# EasyEDA Pro project 数控电源_V3.eprj, schematic Schematic4
Board Name: type 端子; Create Date: 2025-09-15; Page Name: P1; Project Name: 数控电源_V3; Schematic Name: Schematic4; Update Date: 2025-09-15; Company: 嘉立创EDA; Page Size: A2; Version: V3
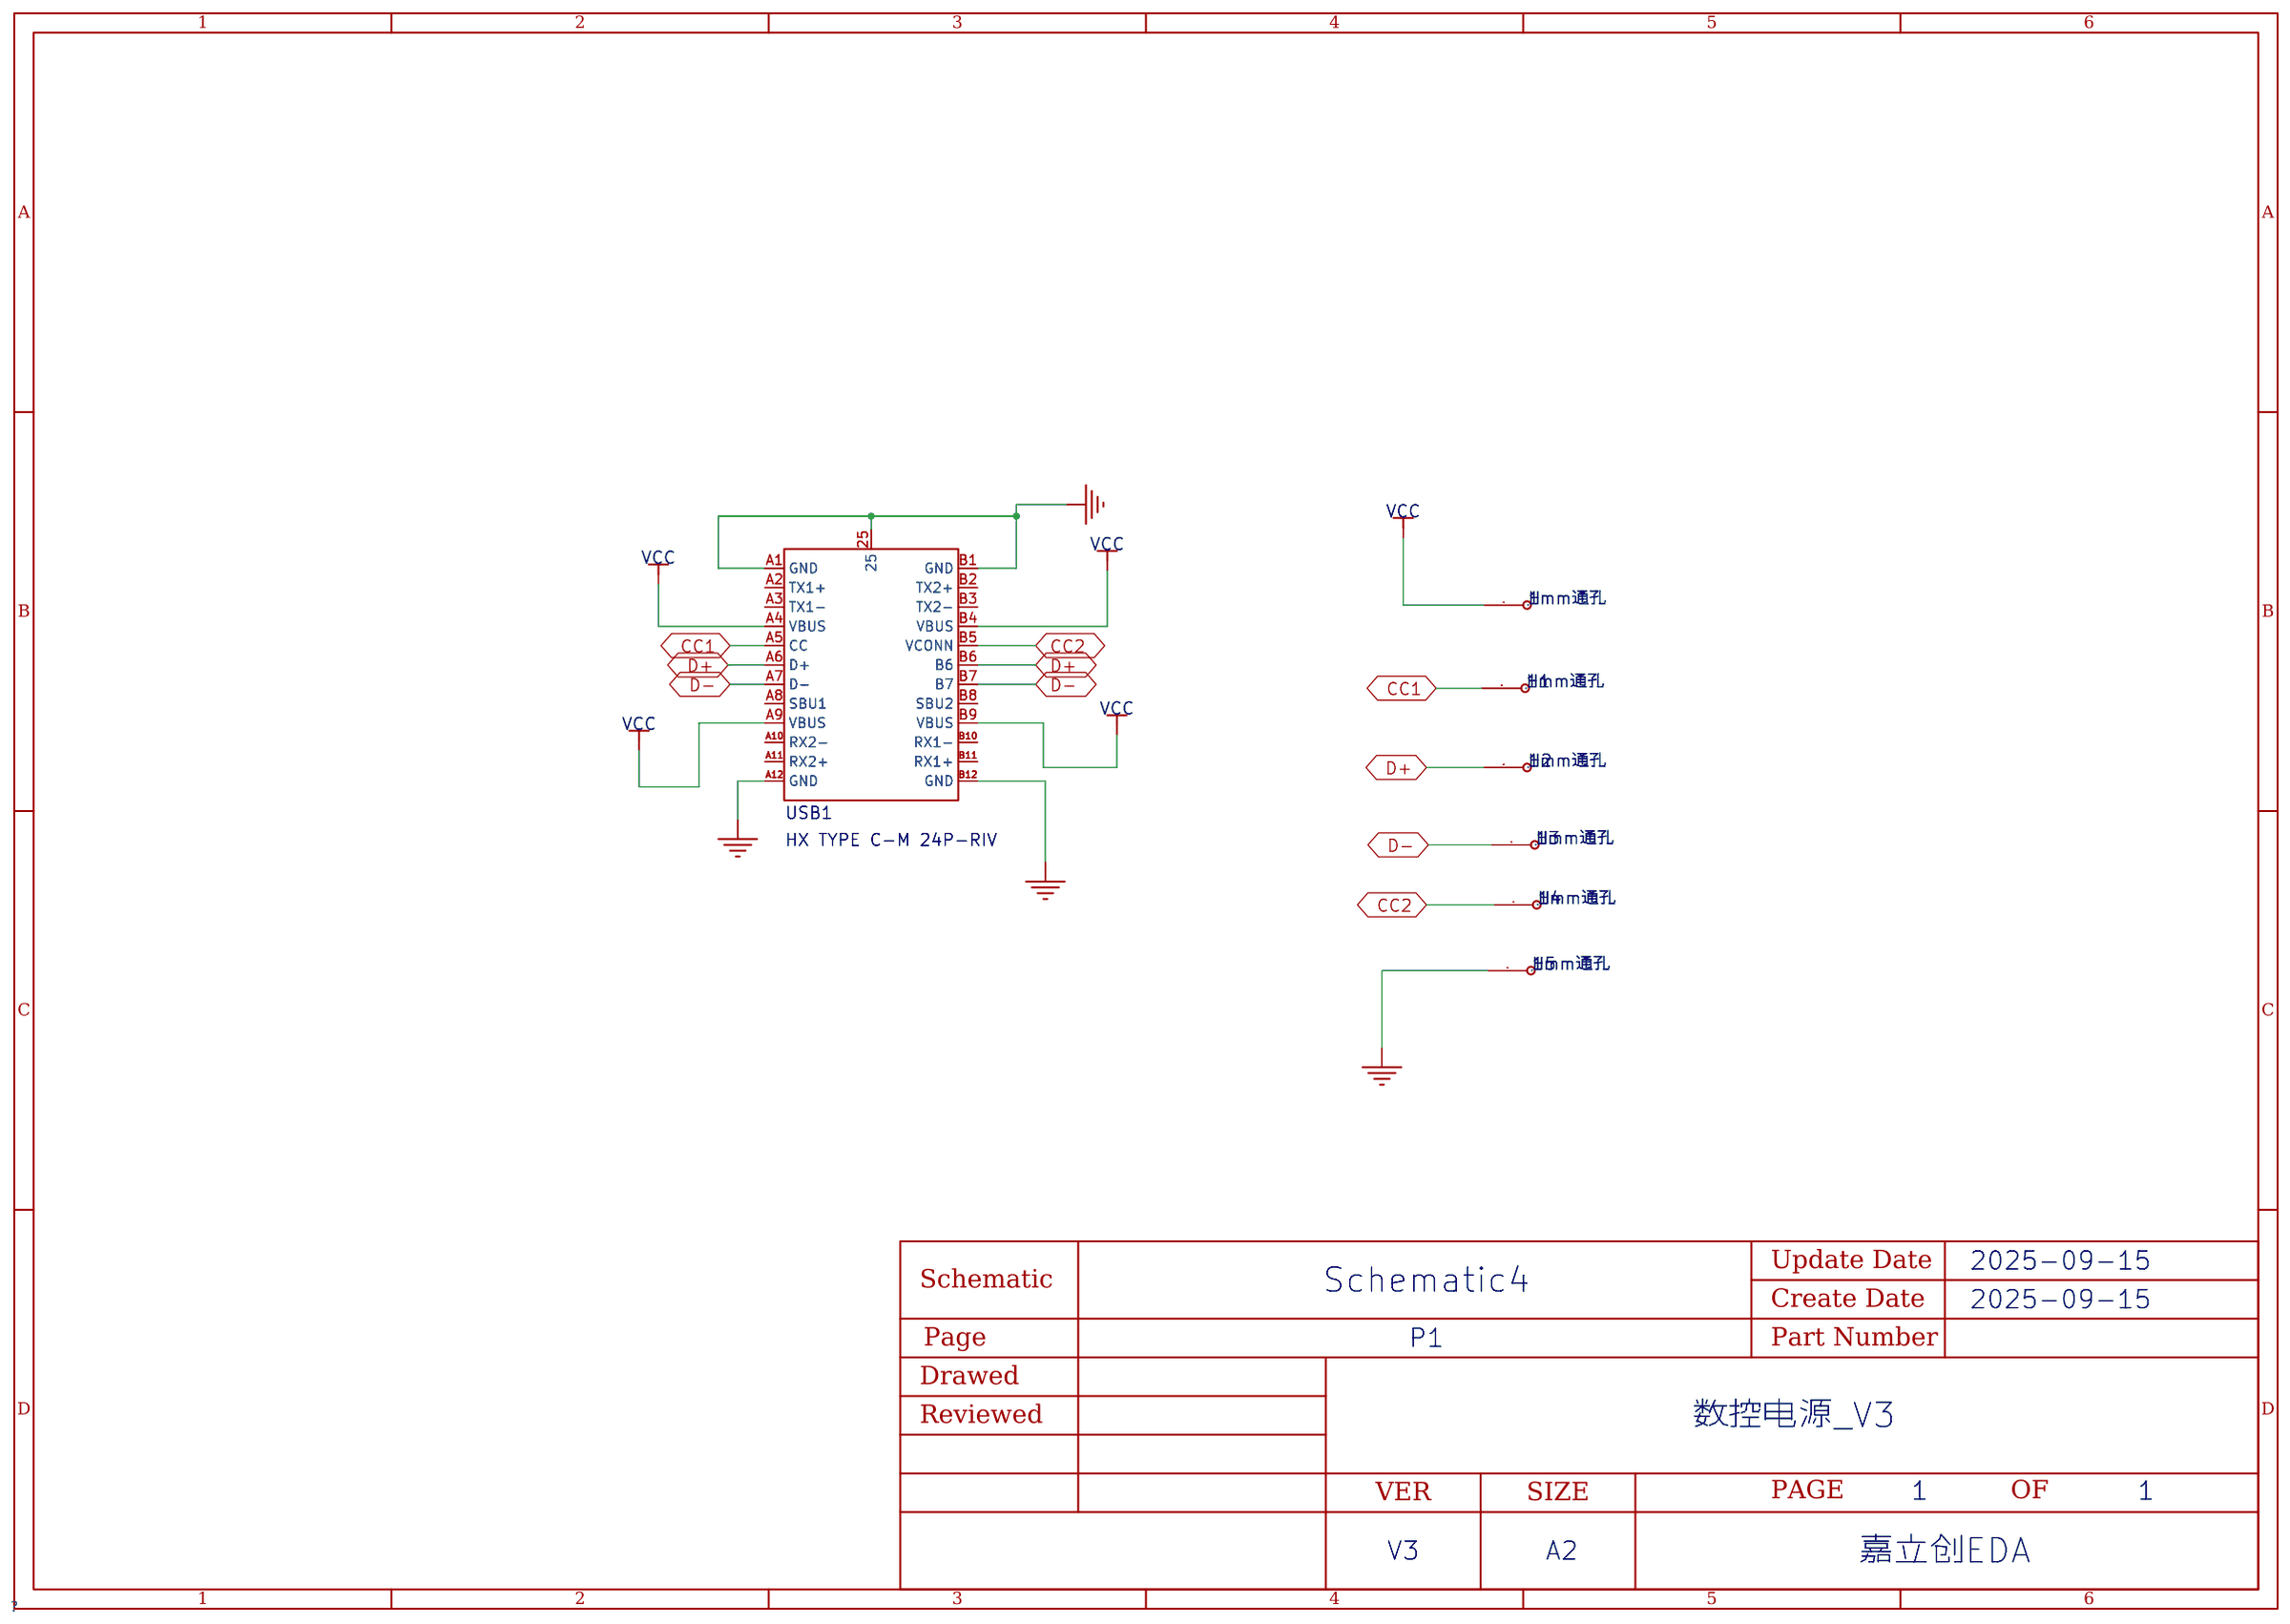
[diagram p1: schematic sheet]

## Parts
H  1mm通孔  [DC-1-DIP]
H1  1mm通孔  [DC-1-DIP]
H2  1mm通孔  [DC-1-DIP]
H3  1mm通孔  [DC-1-DIP]
H4  1mm通孔  [DC-1-DIP]
H5  1mm通孔  [DC-1-DIP]
USB1  HX TYPE C-M 24P-RIV  [TYPE-C-SMD_TYPEC-PLUG-24PIN]

## Library data of the parts
H H1-H5 = DC-1-DIP: 孔径1mm通孔
USB1 = HX TYPE C-M 24P-RIV: 连接器类型:Type-C;协议标准:-;公母:公;安装方式:夹板;触点数量:24P;端口数量:1;额定电流 - 电源:5A;工作温度:-30℃~+80℃;; LCSC Part Name: Type-C 公 夹板; Supplier Part: C42453852; Manufacturer: hanxia(韩下); Supplier Footprint: SMD; Datasheet: https://atta.szlcsc.com/upload/public/pdf/source/20250120/D39E5CF1C7C266C562D731BAAB2A6810.pdf; Supplier: LCSC; Connector Type: Type-C; Gender: 公; Mounting Type: 夹板; Number of Contacts: 24P; Number of Ports: 1; Current Rating-Power: 5A; Voltage Rating: 20V; Connect-Disconnect Life: 1万次; Length: 10.5mm; Detection color: 黑色; Operating Temperature: -30℃~+80℃

## Nets
GND: H5.1 USB1.25 USB1.A1(GND) USB1.A12(GND) USB1.B1(GND) USB1.B12(GND)
VCC: H.1 USB1.A4(VBUS) USB1.A9(VBUS) USB1.B4(VBUS) USB1.B9(VBUS)
CC1: H1.1 USB1.A5(CC)
CC2: H4.1 USB1.B5(VCONN)
D+: H2.1 USB1.A6(D+) USB1.B6
D-: H3.1 USB1.A7(D-) USB1.B7

Not connected (* = marked no-connect by the designer): USB1 A2(TX1+) A3(TX1-) A8(SBU1) A10(RX2-) A11(RX2+) B2(TX2+) B3(TX2-) B8(SBU2) B10(RX1-) B11(RX1+)
